# Altium schematic sheet VRegulator.SchDoc: Title
size A4; Date: *******; ApprovedBy: *******; CheckedBy: None; Author: *******; CompanyName: *******; DrawnBy: Name; Engineer: *******; Organization: *******; Address1: *******; Address2: *******; Address3: *******; Address4: *******; DocumentNumber: Doc Num; Revision: *******; SheetNumber: 6; SheetTotal: 7; Subtitle: Subtitle; Project: Project; VersionRevision: VersionRevision; TotalSheet: TotalSheet; CurrentTime: *******; CurrentDate: *******; Time: *******; DocumentFullPathAndName: *******; DocumentName: *******; ModifiedDate: *******; ImagePath: *******; ProjectName: *******; Application_BuildNumber: *******
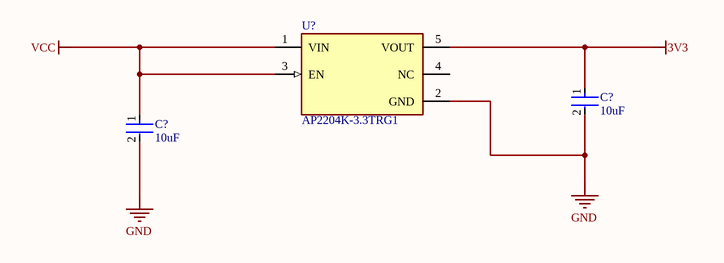
[diagram p0: VRegulator.SchDoc]

## Parts
(Parts that share a designator on the sheet are numbered #1, #2 ... from top to bottom, then left to right.)
C?#1  10uF  [FP-CL10-IPC_A]
C?#2  10uF  [FP-CL10-IPC_A]
U?  AP2204K-3.3TRG1  [FP-SOT25-IPC_C]

## Nets
3V3: C?#1.1 U?.5(VOUT)
GND: C?#1.2 C?#2.2 U?.2(GND)
VCC: C?#2.1 U?.1(VIN) U?.3(EN)

Not connected (* = marked no-connect by the designer): U? 4(NC)

## Notes on the sheet
- Title:
- Drawn By:
- Page Contents:
- Checked By:
- Subtitle:
- University Of Moratuwa
- Moratuwa
- Size:
- Date:
- File:
- Email:
- A4
- lasithnawanjaan123@gmail.com
- Lasith Haputhanthri
- Number:
- Time:
- Revision:
- Sheet
- of
- Katubedda
- 10500
- Sri Lanka

## Library data of the parts
C?#1 C?#2 = CMP-13271-000587-1: Cap Ceramic 100nF 50V X7R ±10% Pad SMD 0603 +125°C T/R; Case/Package: 0603; Depth: 0.8mm; Max Operating Temperature: 125°C; Lead Free: Lead Free; Material: Ceramic; Voltage Rating: 50V; Min Operating Temperature: -55°C; Voltage Rating (DC): 50V; Dielectric: X7R; Height: 0.8mm; Capacitance: 100nF; Thickness: 0.035inch; Radiation Hardening: No; Voltage: 50V; Packaging: Tape and Reel; Length: 1.6mm; Tolerance: 10%; Width: 0.031inch; Mount: Surface Mount; Package Quantity: 10000
U? = CMP-2000-05782-2: IC REG LINEAR 3.3V 150MA SOT23-5; Max Input Voltage: 24V; Min Input Voltage: 2.3V; Quiescent Current: 50uA; Number of Regulators: 1; Max Output Current: 250mA; Reference Voltage: 1.24V; Output Type: Fixed; Polarity: Positive; Dropout Voltage: 360mV; Weight: 0.001058oz; Min Operating Temperature: -40°C; Output Current: 150mA; Lead Free: Lead Free; Length: 3.02mm; Height: 1.3mm; Width: 1.7mm; Case/Package: SOT-23-5; Max Operating Temperature: 85°C; Package Quantity: 3000; Mount: Surface Mount; Output Voltage: 3.3V; Number of Pins: 5; Packaging: Tape and Reel; Number of Outputs: 1